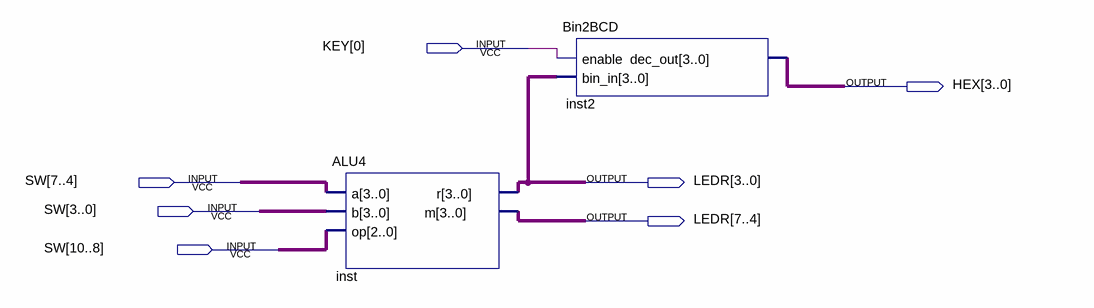
[diagram p0: schematic sheet]
// Quartus schematic HexDemo.bdf as structural Verilog: 2 symbols, 7 pins
module HexDemo (
  input  [0:0] KEY,
  input  [10:0] SW,
  output [3:0] HEX,
  output [7:0] LEDR
);

  ALU4 inst (.a(SW[7:4]), .b(SW[3:0]), .op(SW[10:8]), .r(LEDR[3:0]), .m(LEDR[7:4]));
  Bin2BCD inst2 (.enable(KEY[0]), .bin_in(LEDR[3:0]), .dec_out(HEX));
endmodule
